# EasyEDA schematic SCH_WIRING-SOLENOID_2026-09-01.json
TITLE: Sheet_1; REV: 1.0; Date: 2026-08-31; Sheet: 1/1; Drawn By: 24050874058; Company: Your Company
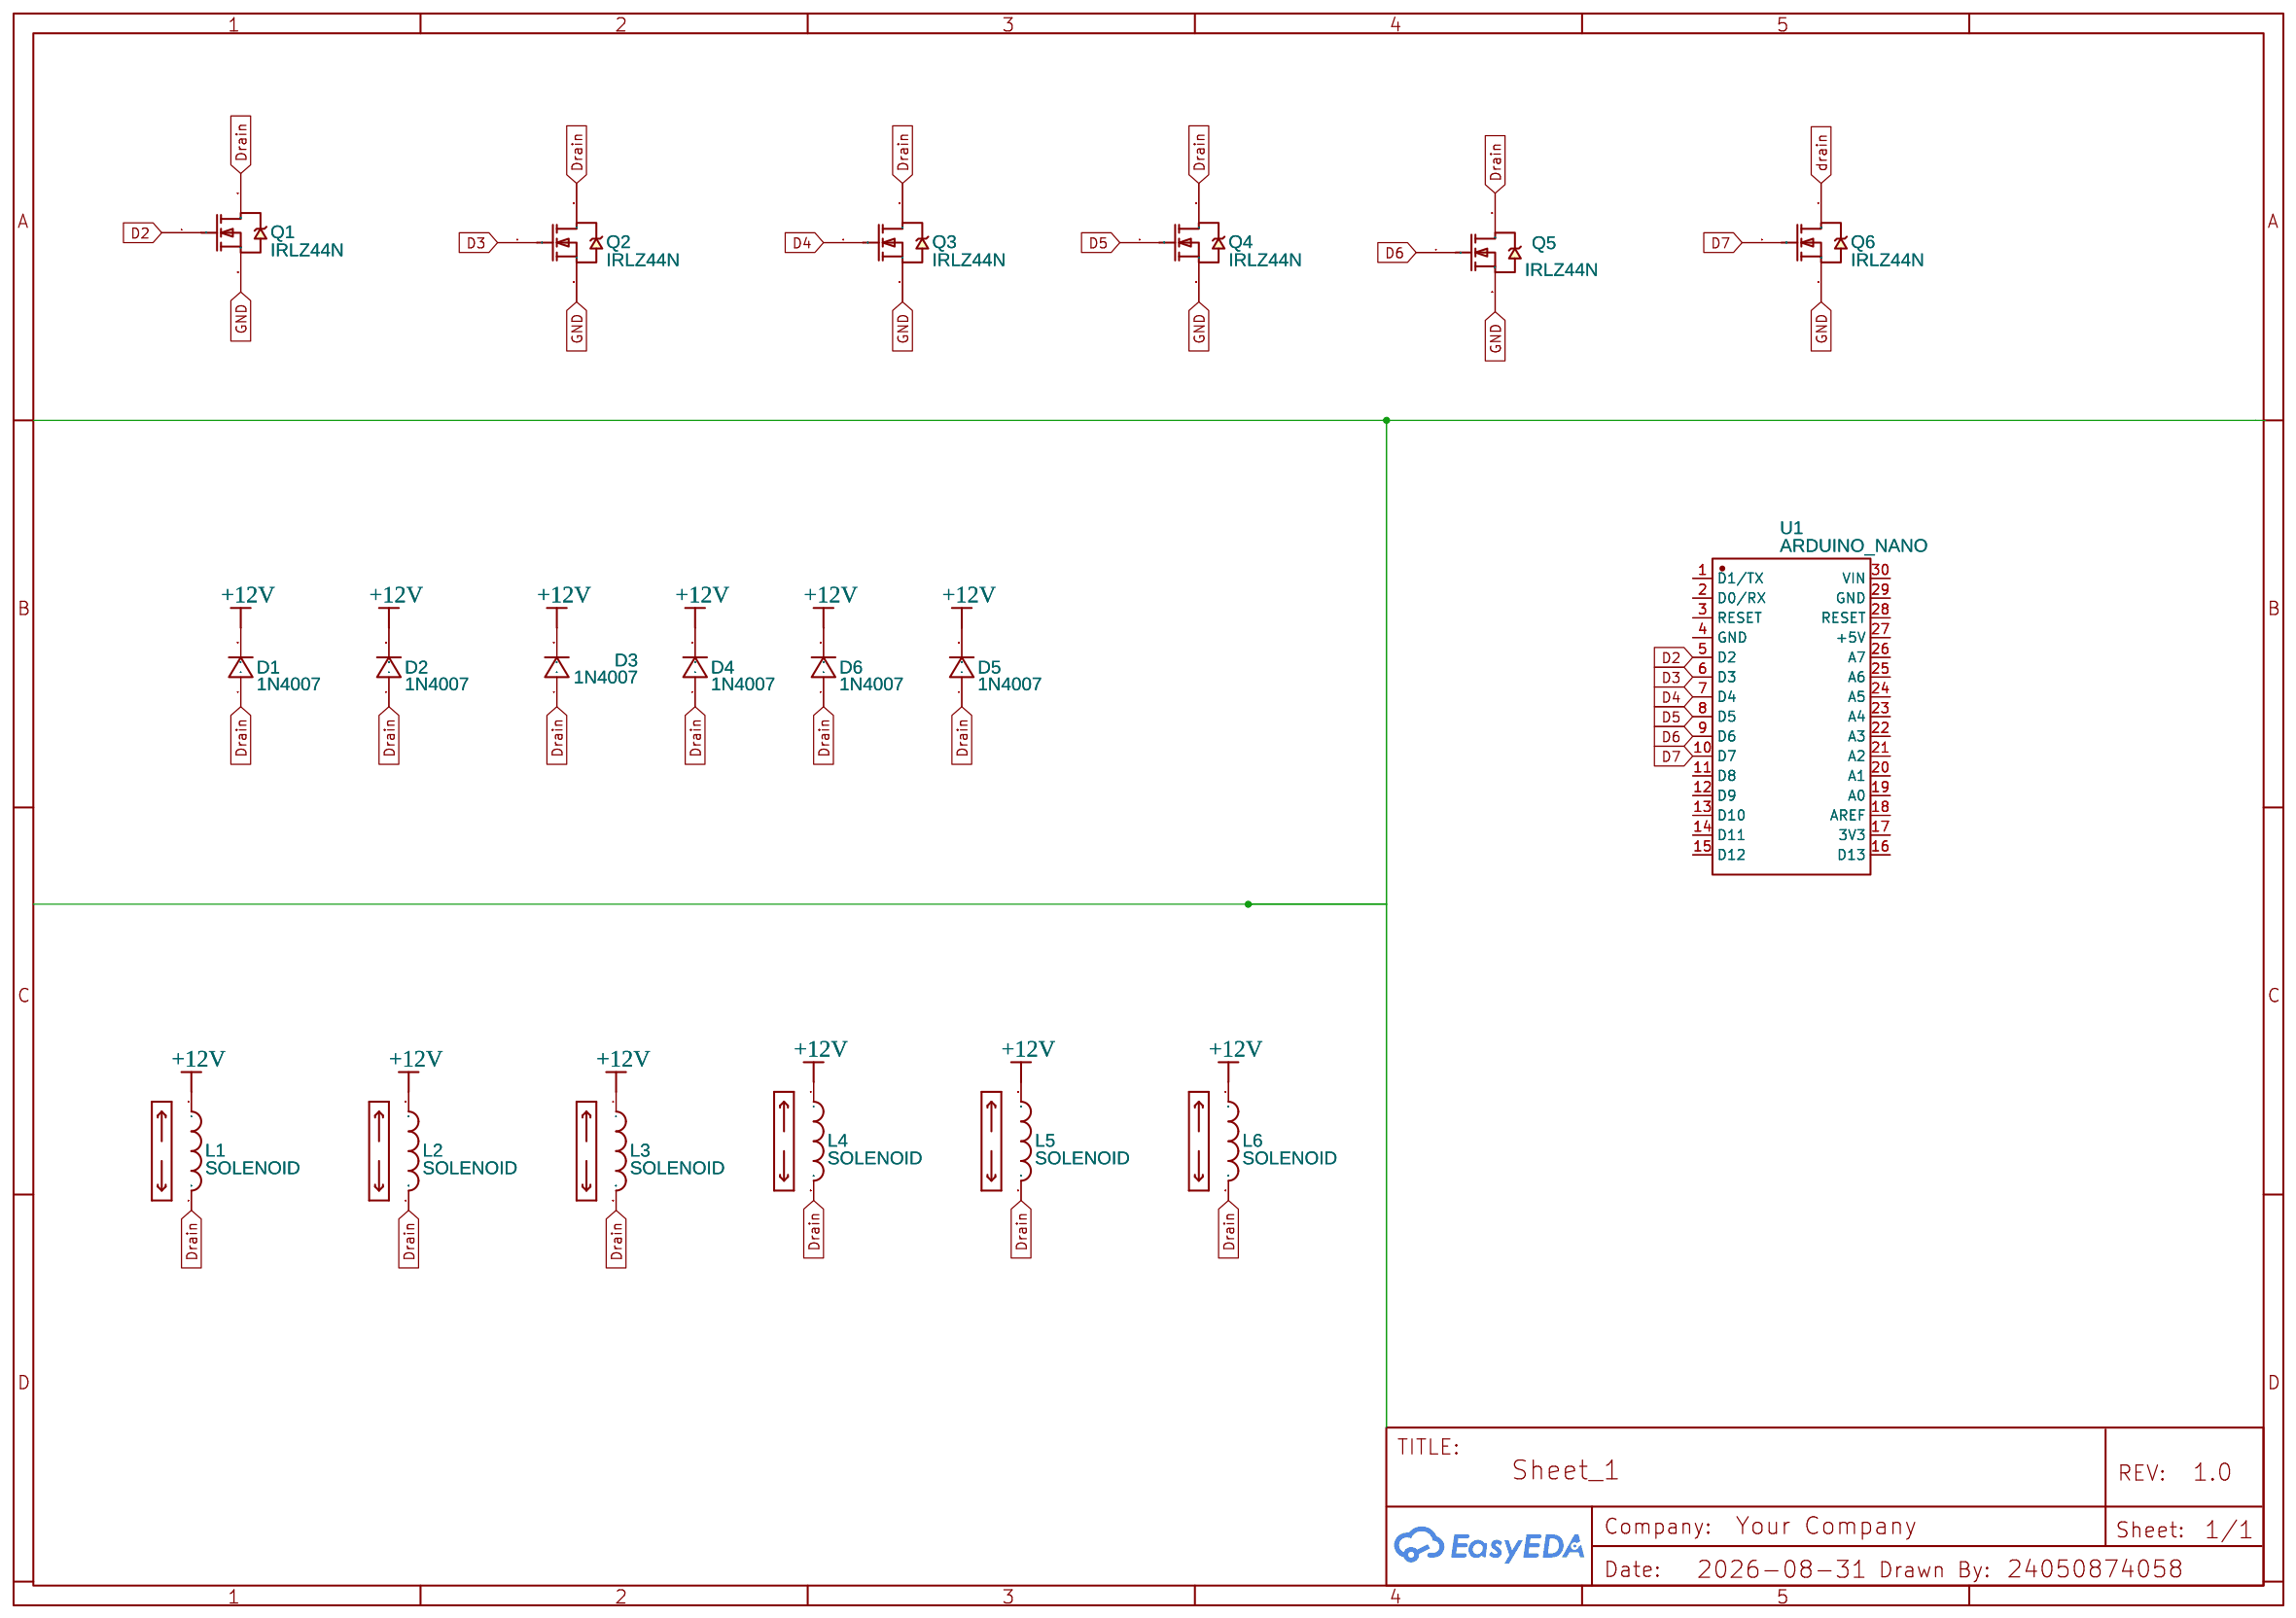
[diagram p0: schematic sheet]

## Parts
D1  1N4007  [1N4007]
D2  1N4007  [1N4007]
D3  1N4007  [1N4007]
D4  1N4007  [1N4007]
D5  1N4007  [1N4007]
D6  1N4007  [1N4007]
L1  SOLENOID  [1X02]
L2  SOLENOID  [1X02]
L3  SOLENOID  [1X02]
L4  SOLENOID  [1X02]
L5  SOLENOID  [1X02]
L6  SOLENOID  [1X02]
Q1  IRLZ44N  [TO-220AB]
Q2  IRLZ44N  [TO-220AB]
Q3  IRLZ44N  [TO-220AB]
Q4  IRLZ44N  [TO-220AB]
Q5  IRLZ44N  [TO-220AB]
Q6  IRLZ44N  [TO-220AB]
U1  ARDUINO_NANO  [COMM-TH_ARDUINO_NANO]

## Library data of the parts
D1-D6 = 1N4007: Manufacturer: Changzhou Starsea Elec; Supplier: LCSC; Supplier Part: C84641; Contributor: Jerhyn York
L1-L6 = SOLENOID
Q1-Q6 = IRLZ44N: HEXFET Power MOSFET
U1 = ARDUINO_NANO: Contributor: lcsc; Supplier: LCSC; Supplier Part: C9900017879; Manufacturer: null; JLCPCB Part Class: Extended Part

## Nets
+12V: D1.2 D2.2 D3.2 D4.2 D5.2 D6.2 L1.1 L2.1 L3.1 L4.1 L5.1 L6.1
GND: Q1.3(S) Q2.3(S) Q3.3(S) Q4.3(S) Q5.3(S) Q6.3(S)
D2: Q1.1(G) U1.5(D2)
D3: Q2.1(G) U1.6(D3)
D4: Q3.1(G) U1.7(D4)
D5: Q4.1(G) U1.8(D5)
D6: Q5.1(G) U1.9(D6)
D7: Q6.1(G) U1.10(D7)
Drain: D1.1 D2.1 D3.1 D4.1 D5.1 D6.1 L1.2 L2.2 L3.2 L4.2 L5.2 L6.2 Q1.2(D) Q2.2(D) Q3.2(D) Q4.2(D) Q5.2(D)
drain: Q6.2(D)

Not connected (* = marked no-connect by the designer): U1 1(D1/TX) 2(D0/RX) 3(RESET) 4(GND) 11(D8) 12(D9) 13(D10) 14(D11) 15(D12) 16(D13) 17(3V3) 18(AREF) 19(A0) 20(A1) 21(A2) 22(A3) 23(A4) 24(A5) 25(A6) 26(A7) 27(+5V) 28(RESET) 29(GND) 30(VIN)
